# EAGLE board 3x8ButV1.3.6 (EAGLE 6.6.0)
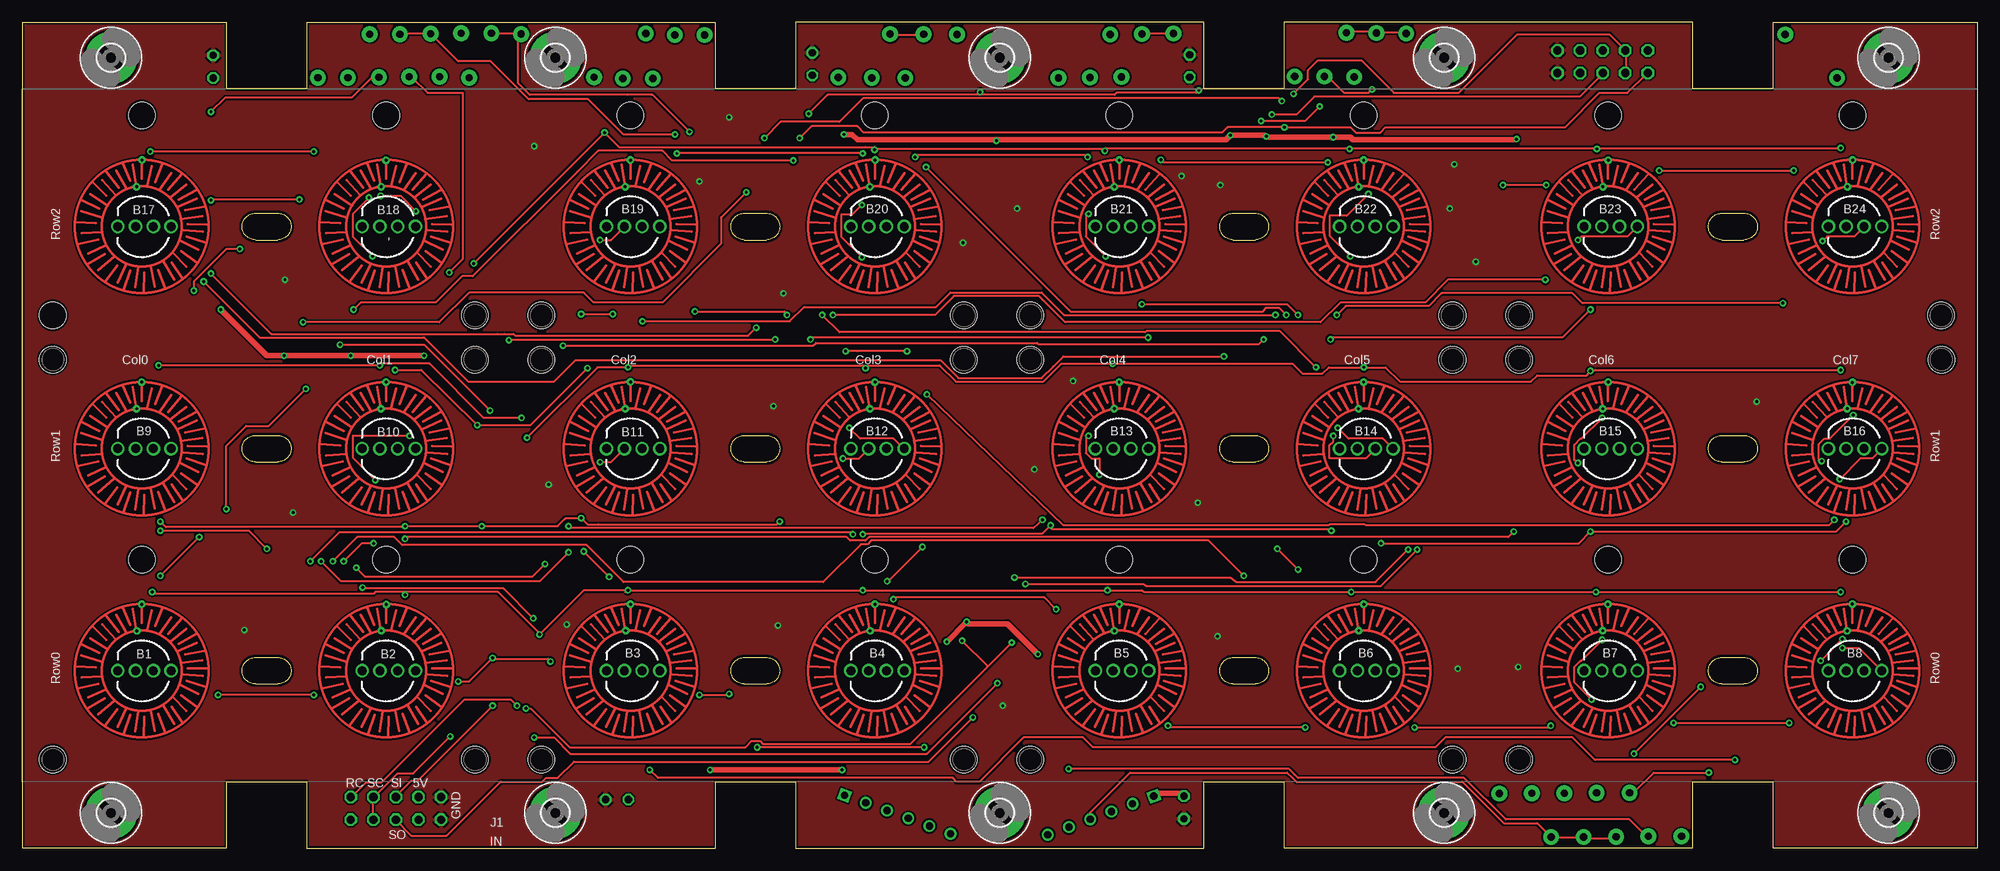
[diagram p1: board, top side]
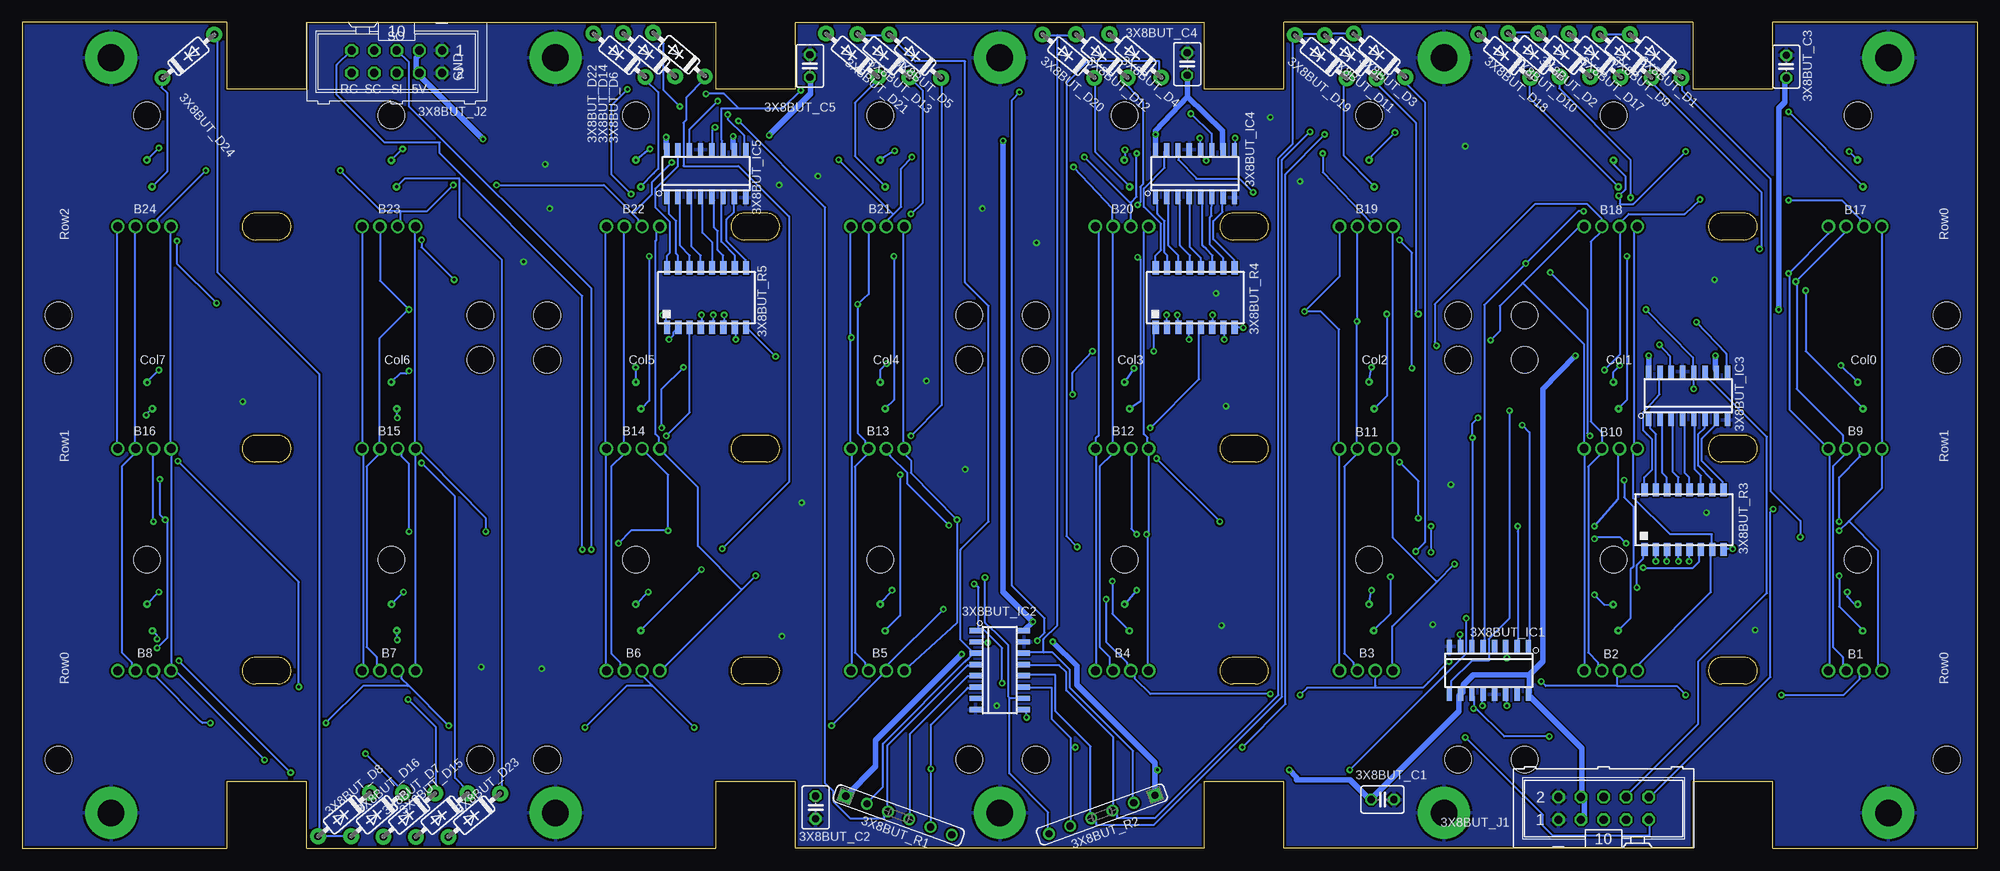
[diagram p2: board, bottom side, seen from below]

Size 220 x 93 mm. Coordinates in mm from the lower left corner, seen from the top.
Outline: 32,0 78,0 78,7.5 87,7.5 87,0 133,0 133,7.5 142,7.5 142,0 188,0 188,7.5 197,7.5 197,0 220,0 220,93 197,93 197,85.5 188,85.5 188,93 142,93 142,85.5 133,85.5 133,93 87,93 87,85.5 78,85.5 78,93 32,93 32,85.5 23,85.5 23,93 0,93 0,0 23,0 23,7.5 32,7.5 32,0
Copper layers (1*16): Top 0.035mm / dielectric 1.5mm / Bottom 0.035mm
Design rules "makePCB *": minimum track width 8mil, minimum drill 13mil, track to track 8mil, track to pad 8mil, pad to pad 8mil, via to via 8mil, smd to smd 8mil, copper to edge 10mil, drill to drill 8mil, minimum pad ring 10mil, minimum via ring 8mil, stop-mask expansion 4mil, vias tented up to drill 0mil, thermal gap 10mil
Net classes: 1 VDD: width 0.61 mm, drill 0.33 mm, clearance 0.355 mm to class 0, clearance 0.355 mm

## Footprints (pad centres in the part's own frame; a part is rotated, then mirrored left to right if it is on the bottom)
BUTTONPAD3X8 = drill 1: BLU1 14.75,12.5; BLU2 42.25,12.5; BLU3 69.75,12.5; BLU4 97.25,12.5; BLU5 124.75,12.5; BLU6 152.25,12.5; BLU7 179.75,12.5; BLU8 207.25,12.5; BLU9 14.75,37.5; BLU10 42.25,37.5; BLU11 69.75,37.5; BLU12 97.25,37.5; BLU13 124.75,37.5; BLU14 152.25,37.5; BLU15 179.75,37.5; BLU16 207.25,37.5; BLU17 14.75,62.5; BLU18 42.25,62.5; BLU19 69.75,62.5; BLU20 97.25,62.5; BLU21 124.75,62.5; BLU22 152.25,62.5; BLU23 179.75,62.5; BLU24 207.25,62.5; GND1 12.75,12.5; GND2 40.25,12.5; GND3 67.75,12.5; GND4 95.25,12.5; GND5 122.75,12.5; GND6 150.25,12.5; GND7 177.75,12.5; GND8 205.25,12.5; GND9 12.75,37.5; GND10 40.25,37.5; GND11 67.75,37.5; GND12 95.25,37.5; GND13 122.75,37.5; GND14 150.25,37.5; GND15 177.75,37.5; GND16 205.25,37.5; GND17 12.75,62.5; GND18 40.25,62.5; GND19 67.75,62.5; GND20 95.25,62.5; GND21 122.75,62.5; GND22 150.25,62.5; GND23 177.75,62.5; GND24 205.25,62.5; GRN1 16.75,12.5; GRN2 44.25,12.5; GRN3 71.75,12.5; GRN4 99.25,12.5; GRN5 126.75,12.5; GRN6 154.25,12.5; GRN7 181.75,12.5; GRN8 209.25,12.5; GRN9 16.75,37.5; GRN10 44.25,37.5; GRN11 71.75,37.5; GRN12 99.25,37.5; GRN13 126.75,37.5; GRN14 154.25,37.5; GRN15 181.75,37.5; GRN16 209.25,37.5; GRN17 16.75,62.5; GRN18 44.25,62.5; GRN19 71.75,62.5; GRN20 99.25,62.5; GRN21 126.75,62.5; GRN22 154.25,62.5; GRN23 181.75,62.5; GRN24 209.25,62.5; RED1 10.75,12.5; RED2 38.25,12.5; RED3 65.75,12.5; RED4 93.25,12.5; RED5 120.75,12.5; RED6 148.25,12.5; RED7 175.75,12.5; RED8 203.25,12.5; RED9 10.75,37.5; RED10 38.25,37.5; RED11 65.75,37.5; RED12 93.25,37.5; RED13 120.75,37.5; RED14 148.25,37.5; RED15 175.75,37.5; RED16 203.25,37.5; RED17 10.75,62.5; RED18 38.25,62.5; RED19 65.75,62.5; RED20 93.25,62.5; RED21 120.75,62.5; RED22 148.25,62.5; RED23 175.75,62.5; RED24 203.25,62.5 | drill 0.33: SIG01 13.447,19.983; SIG02 12.888,16.986; SIG03 40.972,19.958; SIG04 40.413,17.012; SIG05 68.447,19.983; SIG06 67.913,17.012; SIG07 95.947,19.983; SIG08 95.413,16.986; SIG09 123.447,19.983; SIG10 122.888,16.986; SIG11 150.972,19.983; SIG12 150.388,17.012; SIG13 178.447,19.983; SIG14 177.863,17.012; SIG15 205.947,20.009; SIG16 205.363,16.986; SIG17 13.447,44.983; SIG18 12.863,41.986; SIG19 40.947,44.983; SIG20 40.363,41.986; SIG21 68.447,45.009; SIG22 67.863,41.986; SIG23 95.947,44.983; SIG24 95.388,41.986; SIG25 123.447,44.983; SIG26 122.888,42.012; SIG27 150.947,44.983; SIG28 150.363,41.986; SIG29 178.472,44.983; SIG30 177.863,41.986; SIG31 205.947,44.958; SIG32 205.363,42.012; SIG33 13.472,69.983; SIG34 12.863,66.986; SIG35 40.947,69.958; SIG36 40.388,66.986; SIG37 68.447,69.983; SIG38 67.863,66.986; SIG39 95.972,69.983; SIG40 95.388,66.986; SIG41 123.447,69.983; SIG42 122.888,66.986; SIG43 150.947,69.983; SIG44 150.388,66.986; SIG45 178.472,69.958; SIG46 177.888,66.986; SIG47 205.972,69.983; SIG48 205.388,66.986 | hole 3: 13.45,25; 40.95,25; 68.45,25; 95.95,25; 3.434,47.516; 105.966,47.516; 123.45,25; 150.95,25; 178.45,25; 205.95,25; 113.434,47.516; 215.966,47.516; 13.45,75; 40.95,75; 68.45,75; 95.95,75; 123.45,75; 150.95,75; 178.45,75; 205.95,75; 3.434,2.516; 3.434,52.516; 215.934,52.516; 215.934,2.516; 113.434,2.516; 105.934,2.516; 105.934,52.516; 113.434,52.516; 50.934,52.516; 58.434,52.516; 58.434,47.516; 50.934,47.516; 50.934,2.516; 58.434,2.516; 160.934,52.516; 168.434,52.516; 168.434,47.516; 160.934,47.516; 160.934,2.516; 168.434,2.516
C025-030X050 = drill 0.813 octagon: 1 -1.27,0; 2 1.27,0
DO35-7 = drill 0.813 pad 1.778: A 3.81,0; C -3.81,0
SO16D = smd 0.6 x 1.4: 1 -4.481,-2.764; 2 -3.211,-2.764; 3 -1.941,-2.764; 4 -0.671,-2.764; 5 0.599,-2.764; 6 1.869,-2.764; 7 3.139,-2.764; 8 4.409,-2.764; 9 4.409,2.666; 10 3.139,2.666; 11 1.869,2.666; 12 0.599,2.666; 13 -0.671,2.666; 14 -1.941,2.666; 15 -3.211,2.666; 16 -4.481,2.666
ML10 = drill 0.914 octagon: 1 -5.08,-1.27; 2 -5.08,1.27; 3 -2.54,-1.27; 4 -2.54,1.27; 5 0,-1.27; 6 0,1.27; 7 2.54,-1.27; 8 2.54,1.27; 9 5.08,-1.27; 10 5.08,1.27
SIL6 = drill 0.813 square: 1 -6.35,0 | drill 0.813: 2 -3.81,0; 3 -1.27,0; 4 1.27,0; 5 3.81,0; 6 6.35,0
SOIC16W = smd 0.7 x 1.5: 1 -4.445,-3.346; 2 -3.175,-3.346; 3 -1.905,-3.346; 4 -0.635,-3.346; 5 0.635,-3.346; 6 1.905,-3.346; 7 3.175,-3.346; 8 4.445,-3.346; 9 4.445,3.346; 10 3.175,3.346; 11 1.905,3.346; 12 0.635,3.346; 13 -0.635,3.346; 14 -1.905,3.346; 15 -3.175,3.346; 16 -4.445,3.346
3,0-PAD = drill 3 pad 5.842: B3,0 0,0

## Placement (x,y rotation side)
3X8BUT  BUTTONPAD3X8  [BUTTONPAD3X8]  0,7.5 0 top
3X8BUT_C1  100nF  [C025-030X050]  66.93,5.5 0 bottom
3X8BUT_C2  100nF  [C025-030X050]  130.72,4.61 270 bottom
3X8BUT_C3  100n  [C025-030X050]  21.5,88 90 bottom
3X8BUT_C4  100n  [C025-030X050]  88.9,88.29 90 bottom
3X8BUT_C5  100n  [C025-030X050]  131.37,88.08 90 bottom
3X8BUT_D1  1N4148  [DO35-7]  36.19,89.21 140 bottom
3X8BUT_D2  1N4148  [DO35-7]  46.46,89.3 140 bottom
3X8BUT_D3  1N4148  [DO35-7]  67.26,89.27 140 bottom
3X8BUT_D4  1N4148  [DO35-7]  94.75,89.22 140 bottom
3X8BUT_D5  1N4148  [DO35-7]  119.52,89.18 140 bottom
3X8BUT_D6  1N4148  [DO35-7]  146.1,89.35 140 bottom
3X8BUT_D7  1N4148  [DO35-7]  176.45,3.76 220 bottom
3X8BUT_D8  1N4148  [DO35-7]  183.8,3.8 220 bottom
3X8BUT_D9  1N4148  [DO35-7]  39.57,89.21 140 bottom
3X8BUT_D10  1N4148  [DO35-7]  49.88,89.32 140 bottom
3X8BUT_D11  1N4148  [DO35-7]  70.51,89.11 140 bottom
3X8BUT_D12  1N4148  [DO35-7]  98.52,89.19 140 bottom
3X8BUT_D13  1N4148  [DO35-7]  123.07,89.24 140 bottom
3X8BUT_D14  1N4148  [DO35-7]  149.46,89.34 140 bottom
3X8BUT_D15  1N4148  [DO35-7]  172.79,3.74 220 bottom
3X8BUT_D16  1N4148  [DO35-7]  180.08,3.8 220 bottom
3X8BUT_D17  1N4148  [DO35-7]  43.05,89.26 140 bottom
3X8BUT_D18  1N4148  [DO35-7]  53.22,89.21 140 bottom
3X8BUT_D19  1N4148  [DO35-7]  73.88,89.11 140 bottom
3X8BUT_D20  1N4148  [DO35-7]  102.28,89.18 140 bottom
3X8BUT_D21  1N4148  [DO35-7]  126.63,89.28 140 bottom
3X8BUT_D22  1N4148  [DO35-7]  152.81,89.28 140 bottom
3X8BUT_D23  1N4148  [DO35-7]  169.13,3.73 220 bottom
3X8BUT_D24  1N4148  [DO35-7]  201.3,89.16 40 bottom
3X8BUT_IC1  74HC595SO16D  [SO16D]  55,20 180 bottom
3X8BUT_IC2  74HC165NSO16D  [SO16D]  109.95,20.03 270 bottom
3X8BUT_IC3  74HC595  [SO16D]  32.5,51 0 bottom
3X8BUT_IC4  74HC595  [SO16D]  88,76 0 bottom
3X8BUT_IC5  74HC595  [SO16D]  143,76 0 bottom
3X8BUT_J1  IN  [ML10]  42.05,4.5 0 bottom
3X8BUT_J2  [ML10]  177.85,88.55 180 bottom
3X8BUT_R1  10k  [SIL6]  121.37,3.72 340 bottom
3X8BUT_R2  10k  [SIL6]  98.5,3.82 200 bottom
3X8BUT_R3  [SOIC16W]  33,37 0 bottom
3X8BUT_R4  [SOIC16W]  88,62 0 bottom
3X8BUT_R5  [SOIC16W]  143,62 0 bottom
H1  MOUNT-PAD-ROUND3.0  [3,0-PAD]  10,89 0 top
H2  MOUNT-PAD-ROUND3.0  [3,0-PAD]  60,89 0 top
H3  MOUNT-PAD-ROUND3.0  [3,0-PAD]  110,89 0 top
H4  MOUNT-PAD-ROUND3.0  [3,0-PAD]  160,89 0 top
H5  MOUNT-PAD-ROUND3.0  [3,0-PAD]  210,89 0 top
H6  MOUNT-PAD-ROUND3.0  [3,0-PAD]  10,4 0 top
H7  MOUNT-PAD-ROUND3.0  [3,0-PAD]  60,4 0 top
H8  MOUNT-PAD-ROUND3.0  [3,0-PAD]  110,4 0 top
H9  MOUNT-PAD-ROUND3.0  [3,0-PAD]  160,4 0 top
H10  MOUNT-PAD-ROUND3.0  [3,0-PAD]  210,4 0 top
U$1  [VLRLAB]  2.52,21.34 90 top
U$3  [3X8BUT]  218.44,29.67 90 top
U$4  [3X8BUT]  218.44,29.67 90 bottom
U$5  [VLRLAB]  2.8,45.83 270 bottom

## Tracks (layer width: path | path; a pad name or v marks a point on that pad's centre or on a via)
+5V  (via drill 0.33)
  Top 0.61: v168.15,79.86 168.05,79.76 149.76,79.76 149.45,80.06 v147.52,80.06 140.11,80.06 v140,80.16 139.8,80.26 v135.94,80.26 135.43,79.76 109.73,79.76 | v92.46,80.37 93.37,80.37 93.98,79.76 109.73,79.76 | v22.35,60.66 27.53,55.47 v29.46,55.47 v36.98,55.47 v45.21,55.47 | 3X8BUT_R1.1 127.41,5.89 127.71,6.2 130.35,6.2 130.66,5.89 3X8BUT_C2.1 | v104.04,23.27 v106.27,25.5 106.48,25.3 110.85,25.3 v114.3,21.84 | v92.25,8.84 v77.42,8.84 | v109.63,79.65 109.73,79.76
  Bottom 0.61: 88.9,84.63 88.9,86.56 88.9,86.97 3X8BUT_C4.1 | 88.9,84.63 84.94,80.77 84.94,78.74 3X8BUT_IC4.10 | 88.9,84.63 92.46,80.77 v92.46,80.37 92.46,78.74 3X8BUT_IC4.16 | 3X8BUT_J2.3 175.36,89.81 175.36,89.31 175.67,89 175.67,87.68 175.36,87.38 3X8BUT_J2.4 175.26,86.97 v168.15,79.86 | v140,80.16 140,78.84 139.9,78.74 3X8BUT_IC5.10 | v147.52,80.06 147.52,78.74 3X8BUT_IC5.16 | v135.94,80.26 131.27,84.94 131.27,86.77 3X8BUT_C5.1 | v29.46,55.47 29.46,54.05 29.36,53.75 3X8BUT_IC3.10 | v36.98,55.47 36.98,53.75 3X8BUT_IC3.16 | v22.35,60.66 22.35,83.31 21.64,84.02 21.64,86.56 21.54,86.67 3X8BUT_C3.1 | 50.39,19.51 56.69,19.51 57.81,18.39 57.81,18.29 57.91,18.19 57.91,17.58 58.12,17.37 3X8BUT_IC1.10 58.32,17.17 58.32,15.44 68.17,5.59 3X8BUT_C1.1 68.48,5.59 70.61,7.72 76.61,7.72 76.61,8.03 v77.42,8.84 | 50.39,19.51 50.39,17.58 3X8BUT_IC1.16 50.49,17.27 44.5,11.28 44.5,5.79 3X8BUT_J1.4 44.2,5.79 44.2,3.56 44.5,3.25 3X8BUT_J1.3 | v104.04,23.27 101.3,20.52 101.3,18.39 92.56,9.65 92.56,8.84 | 92.56,8.84 92.56,5.99 3X8BUT_R2.1 | 3X8BUT_IC2.16 107.19,24.59 v106.27,25.5 109.63,28.85 v109.63,79.65 | v114.3,21.84 123.95,12.19 123.95,9.25 127.31,5.89 3X8BUT_R1.1 | v92.25,8.84 92.56,8.84 | v45.21,55.47 48.87,51.71 48.87,21.03 50.39,19.51
BLU1  (via drill 0.33)
  Top 0.203: v135.23,55.37 117.14,55.37 116.03,54.25 114.71,52.93 105.36,52.93 103.33,54.97 62.28,54.97 59.84,52.53 50.19,52.53 45.21,57.51 26.72,57.51 v20.42,63.8
  Bottom 0.203: 3X8BUT.BLU1 14.83,20.02 15.14,20.32 15.14,21.54 16.26,22.66 16.26,42.98 14.83,44.4 14.83,44.91 3X8BUT.BLU9 14.83,45.01 15.14,45.31 15.14,46.53 20.32,51.71 20.32,63.8 v20.42,63.8 14.83,69.39 14.83,69.9 3X8BUT.BLU17 | v135.23,55.37 138.48,58.62 3X8BUT_R5.8
BLU2  (via drill 0.33)
  Top 0.203: v139.7,57.3 139.19,56.79 114.3,56.79 114.2,56.9 89.31,56.9 89,56.59 v60.86,56.59
  Bottom 0.203: 3X8BUT.BLU2 42.27,20.02 42.67,20.42 42.67,20.93 43.79,22.05 43.79,42.98 42.27,44.5 42.27,44.91 3X8BUT.BLU10 42.27,46.84 43.48,48.06 43.48,68.28 42.27,69.49 42.27,69.9 3X8BUT.BLU18 42.27,70 42.27,70.92 43.89,72.54 49.78,72.54 61.06,61.27 61.06,57 v60.86,56.59 | v139.7,57.3 139.7,58.52 139.8,58.62 3X8BUT_R5.7
BLU3  (via drill 0.33)
  Top 0.203: v141.02,60.05 117.25,60.05 114.71,62.59 104.44,62.59 102.82,60.96 87.99,60.96 86.36,59.33 81.79,59.33 v69.8,59.33
  Bottom 0.203: 3X8BUT.BLU3 69.8,20.02 70.21,20.42 70.21,20.93 71.22,21.95 71.22,42.98 69.8,44.4 69.8,44.91 3X8BUT.BLU11 69.8,45.01 v69.8,59.33 69.75,59.33 3X8BUT.BLU19 | v141.02,60.05 141.02,58.73 3X8BUT_R5.6 | 69.8,70 3X8BUT.BLU19 | 69.8,69.9 3X8BUT.BLU19
BLU4  (via drill 0.33)
  Top 0.203: v142.24,60.05 141.43,60.86 140,60.86 139.6,60.45 117.96,60.45 117.86,60.55 v101.7,76.71
  Bottom 0.203: 3X8BUT.BLU4 97.33,20.02 97.64,20.32 97.64,21.54 98.75,22.66 98.75,42.98 97.33,44.4 97.33,44.91 3X8BUT.BLU12 97.33,45.01 97.33,69.9 3X8BUT.BLU20 97.33,70 97.33,72.03 v101.7,76.71 | v142.24,60.05 142.24,58.83 142.34,58.73 3X8BUT_R5.5
BLU5  (via drill 0.33)
  Top 0.203: v143.56,60.05 142.34,61.27 v125.98,61.27
  Bottom 0.203: 3X8BUT.BLU5 124.77,20.02 125.17,20.42 125.17,20.93 126.29,22.05 126.29,42.98 124.77,44.5 124.77,44.91 3X8BUT.BLU13 124.77,45.01 125.17,45.41 125.17,45.92 125.98,46.74 v125.98,61.27 | v143.56,60.05 143.56,58.73 3X8BUT_R5.4 | v125.98,61.27 124.77,62.38 124.77,69.9 3X8BUT.BLU21 | v125.98,61.27 125.98,61.37 v125.98,61.27
BLU6  (via drill 0.33)
  Top 0.203: v147.52,46.43 147.52,45.82 147.12,45.41 147.12,43.89 151.18,43.89 152.2,44.91 3X8BUT.BLU14
  Bottom 0.203: v147.52,46.43 144.88,49.07 144.88,58.62 3X8BUT_R5.3 | 3X8BUT.BLU6 152.3,20.02 152.71,20.42 152.71,20.93 153.72,21.95 153.72,42.98 152.3,44.4 152.3,44.91 3X8BUT.BLU14 152.3,45.01 152.3,69.9 3X8BUT.BLU22
BLU7  (via drill 0.33)
  Top 0.203: v147.22,57.3 147.42,57.51 173.33,57.51 v176.48,60.66
  Bottom 0.203: 3X8BUT.BLU7 179.83,20.02 180.14,20.32 180.14,21.54 181.25,22.66 181.25,42.98 179.83,44.4 179.83,44.91 3X8BUT.BLU15 179.83,45.01 179.83,57.4 176.58,60.66 v176.48,60.66 179.73,63.91 179.73,69.9 3X8BUT.BLU23 | v147.22,57.3 146.71,57.81 146.71,58.12 146.2,58.62 3X8BUT_R5.2
BLU8  (via drill 0.33)
  Top 0.203: v147.93,60.05 148.95,61.06 158.29,61.06 159.72,62.48 174.45,62.48 175.56,61.37 v198.12,61.37 | v202.59,68.38 203.1,68.89 206.15,68.89 207.16,69.9 3X8BUT.BLU24
  Bottom 0.203: 3X8BUT.BLU8 207.26,20.02 207.67,20.42 207.67,20.93 208.79,22.05 208.79,42.98 207.26,44.5 207.26,44.91 3X8BUT.BLU16 207.26,45.01 207.37,45.11 207.37,69.8 207.26,69.9 3X8BUT.BLU24 | v147.93,60.05 147.62,59.74 147.62,58.83 147.52,58.73 3X8BUT_R5.1 | v202.59,68.38 202.59,65.84 v198.12,61.37
GND  (via drill 0.33)
  other vias: 110.34,16.05 85.04,25.1 61.26,25.2 24.99,24.59 30.48,37.8 29.57,64.01 57.61,79.04 76.2,75.08 79.55,82.3 85.65,62.48 105.87,68.17 111.96,72.03 130.45,75.69 118.26,52.63 113.89,42.67 134.82,74.68 132.28,38.91 161.14,77.01 160.63,72.03 163.58,66.04 195.17,50.29 168.35,20.42 161.54,20.22 134.52,23.88 84.53,49.78 59.23,40.94
  pour Bottom: 0,93 220,93 220,0 197,0 197,7.5 188,7.5 188,0 142,0 142,7.5 133,7.5 133,0 87,0 87,7.5 78,7.5 78,0 32,0 32,7.5 23,7.5 23,0 0,0
  pour Top: 220,93 220,0 197,0 197,7.5 188,7.5 188,0 142,0 142,7.5 133,7.5 133,0 87,0 87,7.5 78,7.5 78,0 32,0 32,7.5 23,7.5 23,0 0,0 0,93
GND1  (via drill 0.33)
  Top 0.203: v49.07,18.8 50.29,18.8 v52.93,21.44 52.93,21.34 59.13,21.34 v59.44,21.03 | v32.82,17.27 v22.05,17.27 | v79.55,17.37 79.45,17.27 v76.2,17.27 | v128.93,13.82 129.13,13.61 v144.37,13.61 | v172.01,13.82 171.81,13.61 v156.67,13.61 | v185.83,14.12 v198.83,14.12 | v98.04,28.04 98.25,28.25 115.01,28.25 v116.33,26.92
  Bottom 0.203: v52.93,21.44 52.93,22.66 53.03,22.76 3X8BUT_IC1.3 | v49.07,18.8 48.56,18.29 40.54,18.29 | 40.54,18.29 40.54,19.3 40.34,19.51 40.34,19.91 3X8BUT.GND2 | v22.05,17.27 15.04,17.27 13.21,19.1 13.21,19.51 12.8,19.91 3X8BUT.GND1 | v32.82,17.27 33.83,18.29 40.54,18.29 | 67.77,18.09 67.72,18.34 | 67.72,18.34 67.67,19.91 3X8BUT.GND3 | 67.77,18.09 62.38,18.09 61.77,18.69 v59.44,21.03 | v79.55,17.37 93.07,17.37 94.79,19.1 94.79,19.51 95.2,19.91 3X8BUT.GND4 95.3,20.02 95.71,20.42 95.71,20.93 98.04,23.27 v98.04,28.04 | v76.2,17.27 75.39,18.09 67.77,18.09 | 67.77,18.09 67.72,18.34 | v128.93,13.82 122.83,19.91 3X8BUT.GND5 122.73,20.02 122.73,20.52 v116.33,26.92 | 149.1,18.34 150.16,19.41 150.16,19.91 3X8BUT.GND6 | 149.1,18.34 v144.37,13.61 | v172.01,13.82 176.53,18.34 | 176.53,18.34 177.29,19.1 177.29,19.51 177.7,19.91 3X8BUT.GND7 | v156.67,13.61 151.99,18.29 149.15,18.29 149.1,18.34 | v198.83,14.12 199.75,14.12 199.95,14.33 204.83,19.2 204.83,19.51 205.23,19.91 3X8BUT.GND8 | v185.83,14.12 181.66,18.29 176.58,18.29 176.53,18.34
GND9  (via drill 0.33)
  Top 0.203: v51.71,36.27 51.61,36.27 v43.08,36.27 42.98,36.17 16.15,36.17 v15.54,36.78 | v65.02,43.48 66.24,43.48 67.67,44.91 3X8BUT.GND11 | v51.71,36.27 51.31,36.27 v51.71,36.27 | v51.71,36.27 60.25,36.27 61.06,37.08 61.16,37.19 v62.89,37.19 63.6,36.47 64.82,36.47 84.94,36.47 v85.24,36.78 | v92.35,43.89 94.18,43.89 95.2,44.91 3X8BUT.GND12 | v94.59,35.36 94.69,35.46 114.81,35.46 v115.72,36.37 115.62,36.17 115.93,35.97 147.12,35.97 v147.32,35.76 | v152.91,34.34 175.16,34.34 v176.48,35.66 204.11,35.66 v205.23,36.78
  Bottom 0.203: v51.71,36.27 51.71,35.66 51.71,22.86 3X8BUT_IC1.2 | v43.08,36.27 40.44,39.32 40.44,44.81 40.34,44.91 3X8BUT.GND10 | v15.54,36.78 15.54,41.76 13.21,44.09 13.21,44.5 12.8,44.91 3X8BUT.GND9 | v65.02,43.48 62.89,41.35 v62.89,37.19 | v85.24,36.78 v92.35,43.89 | v115.72,36.37 120.4,41.05 120.4,42.27 122.33,44.2 122.33,44.5 122.73,44.91 3X8BUT.GND13 | v94.59,35.36 95.2,35.97 95.2,44.91 3X8BUT.GND12 | 3X8BUT.GND14 150.16,44.91 147.32,42.06 v147.32,35.76 151.49,35.76 v152.91,34.34 | v176.48,35.66 176.48,43.28 177.29,44.09 177.29,44.5 177.7,44.91 3X8BUT.GND15 | v205.23,36.78 205.23,44.91 3X8BUT.GND16
GND17  (via drill 0.33)
  Top 0.203: v41.96,53.85 44.91,53.85 v51.21,47.65 51.41,47.65 57.2,47.65 v63.6,54.05 | v21.23,72.95 21.34,73.05 v31.19,73.05 | v65.02,68.48 66.24,68.48 67.67,69.9 3X8BUT.GND19 | v119.89,77.83 119.69,78.03 100.69,78.03 v100.48,77.83 | v171.5,74.68 v166.62,74.68 | v184.2,76.3 v199.34,76.3 | v128.12,77.52 128.42,77.22 v146.91,77.22 | v94.59,78.23 v73.66,78.23
  Bottom 0.203: v51.21,47.65 50.39,46.84 50.39,22.96 50.49,22.86 3X8BUT_IC1.1 | v41.96,53.85 40.23,55.58 40.23,69.9 3X8BUT.GND18 40.23,70.1 40.23,70.41 39.22,71.42 32.92,71.42 v31.19,73.05 | v21.23,72.95 15.24,72.95 13.21,70.92 13.21,70.41 12.8,70 3X8BUT.GND17 | v65.02,68.48 63.6,67.06 v63.6,54.05 | v100.48,77.83 95.3,72.64 | 95.3,72.64 95.25,72.69 | 95.25,72.69 95.3,70.51 95.3,70 3X8BUT.GND20 | v119.89,77.83 121.11,76.5 121.11,72.24 121.97,71.37 | 121.97,71.37 122.73,70.61 122.73,70 3X8BUT.GND21 | 151.33,71.48 154.53,74.68 v166.62,74.68 | 151.33,71.48 150.67,70.81 150.67,70.41 150.27,70 3X8BUT.GND22 | v171.5,74.68 174.45,71.73 177.39,71.73 | 177.39,71.73 177.39,70.31 177.7,70 3X8BUT.GND23 | v199.34,76.3 204.83,70.81 204.83,70.41 205.23,70 3X8BUT.GND24 | v184.2,76.3 179.63,71.73 177.39,71.73 | v128.12,77.52 122.02,71.42 121.97,71.37 | v146.91,77.22 149.15,74.98 149.15,73.66 151.28,71.53 151.33,71.48 | v73.66,78.23 73.66,76.1 68.17,70.41 67.77,70 3X8BUT.GND19 | v94.59,78.23 94.59,73.36 95.25,72.69 | 95.3,72.64 95.25,72.69 | 95.25,72.69 95.3,72.64 | 95.3,72.64 95.25,72.69 | 95.25,72.69 95.3,72.64 | 95.3,72.64 95.25,72.69 | 95.3,72.64 95.25,72.69
GRN1  (via drill 0.33)
  Top 0.203: v82.6,58.62 81.69,57.71 55.47,57.71 55.27,57.91 54.25,57.91 53.44,57.91 28.04,57.91 v21.23,64.72
  Bottom 0.203: 3X8BUT.GRN1 16.66,20.02 16.66,44.91 3X8BUT.GRN9 16.76,45.01 21.13,49.38 21.13,64.72 v21.23,64.72 16.76,69.19 16.76,69.9 3X8BUT.GRN17 | v82.6,58.62 83.52,58.62 3X8BUT_R4.8
GRN2  (via drill 0.33)
  Top 0.203: 54.86,57.3 v84.73,57.3 | 54.86,57.3 54.76,57.3 54.86,57.3 | v54.76,57.2 54.86,57.3
  Bottom 0.203: 3X8BUT.GRN2 44.2,20.02 44.2,44.91 3X8BUT.GRN10 44.3,45.01 44.3,56.79 51.1,63.6 51.16,63.65 | v84.73,57.3 84.73,58.62 3X8BUT_R4.7 | v54.76,57.2 53.75,58.22 53.75,61.06 51.16,63.65 | 51.16,63.65 44.91,69.9 44.3,69.9 3X8BUT.GRN18
GRN3  (via drill 0.33)
  Top 0.203: v86.06,60.05 85.75,60.45 v75.69,60.45
  Bottom 0.203: v86.06,60.05 86.06,58.73 3X8BUT_R4.6 | 3X8BUT.GRN19 71.73,64.41 v75.69,60.45 73.86,60.45 71.83,58.42 71.83,45.01 3X8BUT.GRN11 71.83,44.91 71.83,20.02 3X8BUT.GRN3
GRN4  (via drill 0.33)
  Top 0.203: v93.07,47.35 94.28,46.13 98.04,46.13 99.16,45.01 3X8BUT.GRN12
  Bottom 0.203: v93.07,47.35 87.58,52.83 87.58,58.42 87.38,58.62 3X8BUT_R4.5 | 3X8BUT.GRN4 99.16,20.02 99.16,44.91 3X8BUT.GRN12 99.16,45.01 99.16,46.23 98.86,46.53 98.86,69.6 99.16,69.9 3X8BUT.GRN20
GRN5  (via drill 0.33)
  Top 0.203: v88.7,57.3 88.9,57.51 v126.69,57.51
  Bottom 0.203: v88.7,57.3 88.7,58.62 3X8BUT_R4.4 | 3X8BUT.GRN5 126.69,20.02 126.69,44.91 3X8BUT.GRN13 126.8,45.01 126.8,57.4 v126.69,57.51 126.8,57.51 126.8,69.9 3X8BUT.GRN21
GRN6  (via drill 0.33)
  Top 0.203: v90.02,60.05 91.95,58.12 126.39,58.12 126.49,58.22 141.53,58.22 v145.59,54.15 | v148.03,47.35 149.25,46.13 153.11,46.13 154.23,45.01 3X8BUT.GRN14
  Bottom 0.203: v90.02,60.05 90.02,58.83 89.92,58.73 3X8BUT_R4.3 | v145.59,54.15 148.03,51.71 v148.03,47.35 | 3X8BUT.GRN6 154.33,20.02 154.33,44.91 3X8BUT.GRN14 154.33,45.01 154.33,69.9 3X8BUT.GRN22
GRN7  (via drill 0.33)
  Top 0.203: v91.24,60.05 102.72,60.05 104.85,62.18 112.88,62.18 112.98,62.18 114.4,62.18 114.81,61.77 114.91,61.67 117.35,59.23 146.1,59.23 148.34,61.47 157.89,61.47 160.43,64.01 v171.4,64.01 | v175.06,68.48 175.46,68.89 180.65,68.89 181.66,69.9 3X8BUT.GRN23
  Bottom 0.203: 3X8BUT.GRN7 181.66,20.02 181.66,44.91 3X8BUT.GRN15 181.76,45.01 181.76,69.9 3X8BUT.GRN23 | v91.24,60.05 91.24,58.73 3X8BUT_R4.2 | v175.06,68.48 175.06,67.67 v171.4,64.01
GRN8  (via drill 0.33)
  Top 0.203: v92.66,55.98 93.98,55.98 v99.57,55.98 | v101.8,51.1 117.14,36.37 147.01,36.37 147.12,36.47 151.08,36.47 151.18,36.37 203.3,36.37 v203.91,36.98 | v204.52,41.55 206.86,43.89 208.18,43.89 209.19,44.91 3X8BUT.GRN16 | v204.83,22.55 206.65,22.55 209.19,20.02 3X8BUT.GRN8
  Bottom 0.203: v92.66,55.98 92.66,58.42 92.46,58.62 3X8BUT_R4.1 | v99.57,55.98 101.8,53.54 v101.8,51.1 | v204.52,41.55 204.52,37.59 v203.91,36.98 203.71,36.78 203.71,23.67 v204.83,22.55 | 3X8BUT.GRN24 209.3,69.9 209.3,45.01 3X8BUT.GRN16
N$1  (via drill 0.33)
  Top 0.203: v21.23,82.91 22.86,84.53 37.08,84.53 39.32,86.77 40.13,86.77 3X8BUT_D17.C
  Bottom 0.203: v21.23,82.91 12.9,74.57 3X8BUT.SIG34
N$2  (via drill 0.33)
  Top 0.203: v24.49,67.46 22.96,67.46 22.86,67.36 19.3,63.8 v19.3,62.79
  Bottom 0.203: v19.3,62.79 19.3,55.98 12.9,49.58 3X8BUT.SIG18 | v24.49,67.46 24.28,67.67 24.28,73.86 36.58,86.16 36.58,86.67 3X8BUT_D9.C
N$3  (via drill 0.33)
  Top 0.203: v19.91,35.05 v15.54,30.68
  Bottom 0.203: v15.54,30.68 15.54,27.23 12.9,24.59 3X8BUT.SIG02 | v19.91,35.05 19.91,36.88 23.27,40.23 23.27,75.39 33.22,85.34 33.22,86.67 3X8BUT_D1.C
N$4
  Bottom 0.203: 3X8BUT.SIG36 40.44,74.57 50.39,84.53 50.39,86.67 3X8BUT_D18.C
N$5  (via drill 0.33)
  Top 0.203: v39.42,66.65 37.19,68.89 37.19,71.42 v39.01,73.25
  Bottom 0.203: v39.42,66.65 39.42,50.49 40.34,49.58 3X8BUT.SIG20 | v39.01,73.25 39.01,77.52 47.04,85.55 47.04,86.77 3X8BUT_D10.C
N$6  (via drill 0.33)
  Top 0.203: v39.73,41.45 37.19,43.99 37.19,46.43 v43.59,46.43 | v48.06,64.82 49.58,66.34 49.58,85.04 45.62,85.04 43.89,86.77 43.59,86.77 3X8BUT_D2.C
  Bottom 0.203: v39.73,41.45 39.73,39.52 38.71,38.51 38.71,31.7 39.01,31.39 39.01,25.91 40.34,24.59 3X8BUT.SIG04 | v43.59,46.43 43.89,46.74 43.89,60.66 v48.06,64.82
N$7
  Bottom 0.203: 3X8BUT.SIG38 67.87,74.57 71.32,78.03 71.32,85.85 71.02,86.16 71.02,86.56 3X8BUT_D19.C
N$8  (via drill 0.33)
  Top 0.203: v66.45,60.15 62.99,60.15 v62.89,60.15
  Bottom 0.203: v66.45,60.15 66.45,50.9 67.77,49.58 3X8BUT.SIG22 | v62.89,60.15 63.2,60.45 63.2,81.69 67.56,86.06 67.56,86.56 3X8BUT_D11.C
N$9
  Bottom 0.203: 3X8BUT_IC5.15 146.2,78.64 146.2,76.81 148.74,74.27 148.74,72.14 147.12,70.51 147.12,67.06 147.42,66.75 147.42,65.43 3X8BUT_R5.16
N$10
  Bottom 0.203: 3X8BUT_IC5.1 147.42,73.15 147.22,72.95 147.22,71.42 146.41,70.61 146.41,66.95 146.2,66.75 146.2,65.43 3X8BUT_R5.15
N$11
  Bottom 0.203: 3X8BUT_IC5.2 146.2,73.15 146,72.95 146,67.87 144.88,66.75 144.88,65.43 3X8BUT_R5.14
N$12
  Bottom 0.203: 3X8BUT_IC5.3 144.88,73.15 144.68,72.95 144.68,67.77 143.66,66.75 143.66,65.43 3X8BUT_R5.13
N$13
  Bottom 0.203: 3X8BUT_IC5.4 143.66,73.15 143.46,72.95 143.46,69.29 142.34,68.17 142.34,65.43 3X8BUT_R5.12
N$14
  Bottom 0.203: 3X8BUT_IC5.5 142.34,73.15 142.14,72.95 142.14,69.9 141.73,69.49 141.73,67.36 141.12,66.75 141.12,65.43 3X8BUT_R5.11
N$15
  Bottom 0.203: 3X8BUT_IC5.6 141.22,73.15 141.33,73.05 141.33,68.28 139.8,66.75 139.8,65.43 3X8BUT_R5.10
N$16
  Bottom 0.203: 3X8BUT_IC5.7 139.9,73.15 139.9,71.63 140.72,70.81 140.72,68.38 138.58,66.24 138.58,65.43 3X8BUT_R5.9
N$17
  Bottom 0.203: 3X8BUT_IC3.15 35.76,53.65 35.76,53.54 35.76,51.1 37.59,49.07 37.59,47.04 37.19,46.63 36.58,46.02 36.58,42.67 37.49,41.76 37.49,40.44 3X8BUT_R3.16
N$18
  Bottom 0.203: 3X8BUT_IC3.1 36.88,48.16 36.78,48.06 36.78,47.24 36.17,46.63 36.17,40.44 3X8BUT_R3.15
N$19
  Bottom 0.203: 3X8BUT_IC3.2 35.66,48.16 35.46,47.95 35.46,42.27 34.95,41.76 34.95,40.44 3X8BUT_R3.14
N$20
  Bottom 0.203: 3X8BUT_IC3.3 34.34,48.16 34.24,48.06 34.24,42.37 33.63,41.76 33.63,40.44 3X8BUT_R3.13
N$21
  Bottom 0.203: 3X8BUT_IC3.4 33.12,48.16 32.92,47.95 32.92,42.27 32.41,41.76 32.41,40.44 3X8BUT_R3.12
N$22
  Bottom 0.203: 3X8BUT_IC3.5 31.8,48.16 31.8,42.67 31.09,41.96 31.09,40.44 3X8BUT_R3.11
N$23
  Bottom 0.203: 3X8BUT_IC3.6 30.68,48.16 30.68,47.35 31.39,46.63 31.39,43.08 29.87,41.55 29.87,40.44 3X8BUT_R3.10
N$24
  Bottom 0.203: 3X8BUT_IC3.7 29.36,48.16 29.46,47.85 29.46,47.65 30.99,46.13 30.99,43.59 28.65,41.25 28.65,40.44 3X8BUT_R3.9
N$65
  Bottom 0.203: 3X8BUT_IC4.15 91.24,78.64 91.44,78.44 91.44,76.61 93.78,74.27 93.78,72.24 91.85,70.31 91.85,67.36 92.46,66.75 92.46,65.43 3X8BUT_R4.16
N$66
  Bottom 0.203: 3X8BUT_IC4.1 92.46,73.15 92.25,72.95 92.25,71.42 91.44,70.61 91.44,67.06 91.14,66.75 91.14,65.43 3X8BUT_R4.15
N$67
  Bottom 0.203: 3X8BUT_IC4.2 91.14,73.15 91.03,73.05 91.03,67.87 89.92,66.75 89.92,65.43 3X8BUT_R4.14
N$68
  Bottom 0.203: 3X8BUT_IC4.3 89.92,73.15 89.71,72.95 89.71,67.87 88.59,66.75 88.59,65.43 3X8BUT_R4.13
N$69
  Bottom 0.203: 3X8BUT_IC4.4 88.59,73.15 88.59,67.67 87.38,66.45 87.38,65.43 3X8BUT_R4.12
N$70
  Bottom 0.203: 3X8BUT_IC4.5 87.38,73.15 87.17,72.95 87.17,67.87 86.77,67.46 86.06,66.75 86.06,65.43 3X8BUT_R4.11
N$71
  Bottom 0.203: 3X8BUT_IC4.6 86.16,71.22 86.36,71.02 86.36,67.97 84.84,66.45 84.84,65.43 3X8BUT_R4.10
N$72
  Bottom 0.203: 3X8BUT_IC4.7 84.94,73.15 84.94,71.63 85.95,70.61 85.95,68.58 83.62,66.24 83.62,65.43 3X8BUT_R4.9
N$73  (via drill 0.33)
  Top 0.203: v63.2,33.43 v66.04,30.58
  Bottom 0.203: v66.04,30.58 66.04,26.42 67.87,24.59 3X8BUT.SIG06 | v63.2,33.43 62.18,34.44 62.18,84.02 64.31,86.16 64.31,86.77 3X8BUT_D3.C
N$74
  Bottom 0.203: 3X8BUT.SIG40 95.4,74.57 99.26,78.44 99.26,86.67 3X8BUT_D20.C
N$75  (via drill 0.33)
  Top 0.203: v94.49,66.55 92.15,68.89 92.15,71.32 93.37,71.32 v94.49,72.44
  Bottom 0.203: v94.49,66.55 94.39,66.55 94.18,66.34 94.18,50.29 95.3,49.58 3X8BUT.SIG24 | v94.49,72.44 94.18,72.75 94.18,74.47 93.88,74.78 93.88,83.72 93.88,84.02 95.5,85.75 95.5,86.67 3X8BUT_D12.C
N$76  (via drill 0.33)
  Top 0.203: v101.3,33.93 97.54,30.18 v97.33,30.07
  Bottom 0.203: v97.33,30.07 97.33,26.42 95.5,24.59 3X8BUT.SIG08 | v101.3,33.93 102.51,35.15 102.51,86.16 100.08,88.59 92.05,88.59 92.05,87.07 91.85,86.87 3X8BUT_D4.C
N$77
  Bottom 0.203: 3X8BUT.SIG42 122.94,74.57 126.29,77.93 126.29,83.92 123.75,86.46 123.75,86.77 3X8BUT_D21.C
N$78  (via drill 0.33)
  Top 0.203: v121.92,66.65 119.69,68.89 119.69,71.42 v119.99,71.42
  Bottom 0.203: v121.92,66.65 121.92,50.49 122.83,49.58 3X8BUT.SIG26 | v119.99,71.42 118.67,72.64 118.67,85.34 120.09,86.77 3X8BUT_D13.C
N$79  (via drill 0.33)
  Top 0.203: v121.21,42.06 121.21,43.89 120.29,43.89 119.69,44.5 119.69,46.43 v119.99,46.43
  Bottom 0.203: v121.21,42.06 121.21,26.21 122.83,24.59 3X8BUT.SIG10 | v119.99,46.43 116.53,49.89 116.53,86.67 3X8BUT_D5.C
N$80
  Bottom 0.203: 3X8BUT.SIG44 150.37,74.57 148.95,76 148.44,76.5 148.44,85.14 149.86,86.46 149.86,86.77 3X8BUT_D22.C
N$81  (via drill 0.33)
  Top 0.203: v149.45,66.65 147.12,68.99 147.12,71.22 149.05,71.22 v151.49,73.66 | v151.89,85.45 151.49,85.04 148.74,85.04 146.91,86.87 146.61,86.87 3X8BUT_D14.C
  Bottom 0.203: v149.45,66.65 149.45,50.39 150.27,49.58 3X8BUT.SIG28 | v151.49,73.66 153.72,75.89 153.72,83.62 v151.89,85.45
N$82  (via drill 0.33)
  Top 0.203: v141.22,33.73 v143.56,31.39
  Bottom 0.203: v143.56,31.39 145.69,29.26 150.37,24.59 3X8BUT.SIG12 | v141.22,33.73 133.71,41.25 133.71,71.12 139.4,76.81 145.59,76.81 145.59,81.69 145.29,81.99 145.29,84.53 143.26,86.56 143.26,86.87 3X8BUT_D6.C
N$83  (via drill 0.33)
  Top 0.203: v177.8,23.47 175.46,21.13 175.36,21.13 174.65,20.42 174.65,18.69 v176.58,16.76
  Bottom 0.203: v177.8,23.47 177.8,24.49 3X8BUT.SIG14 | v176.58,16.76 173.43,13.61 173.43,6.3 3X8BUT_D7.C
N$84  (via drill 0.33)
  Top 0.203: v177.8,48.46 175.46,46.13 175.36,46.13 174.65,45.41 174.65,43.69 174.75,43.69 v175.06,43.38
  Bottom 0.203: v177.8,48.46 177.8,49.48 3X8BUT.SIG30 | v175.06,43.38 171.3,39.62 171.3,7.92 169.88,6.5 3X8BUT_D15.C
N$85
  Bottom 0.203: 3X8BUT.SIG46 177.8,74.57 176.99,75.39 170.79,75.39 170.79,71.02 166.01,66.24 166.01,6.3 166.12,6.2 3X8BUT_D23.C
N$86
  Bottom 0.203: 3X8BUT.SIG48 205.33,74.57 203.71,76.2 203.71,85.04 204.32,85.65 204.32,86.67 3X8BUT_D24.C
N$87  (via drill 0.33)
  Top 0.203: v206.04,48.77 203.4,46.13 202.79,46.13 202.18,45.52 202.18,43.59 v202.49,43.59 | v181.36,10.67 v188.87,18.19
  Bottom 0.203: v206.04,48.77 206.04,48.87 205.44,49.48 3X8BUT.SIG32 | v202.49,43.59 188.87,29.97 v188.87,18.19 | v181.36,10.67 177.19,6.5 177.19,6.3 3X8BUT_D16.C
N$88  (via drill 0.33)
  Top 0.203: v202.39,21.13 v204.83,23.57 | v189.79,8.53 183.59,8.53 181.36,6.3 180.95,6.3 3X8BUT_D8.C
  Bottom 0.203: v204.83,23.57 204.83,23.98 205.33,24.49 3X8BUT.SIG16 | v189.79,8.53 v202.39,21.13
RC-I  (via drill 0.33)
  Top 0.203: v109.73,18.59 101.8,10.67 61.67,10.67 59.84,12.5 v57.61,12.5 | v156.97,33.63 152.91,29.57 126.49,29.57 126.19,29.77 v112.88,29.77
  Bottom 0.203: 112.37,24.59 111.76,24.59 110.85,23.67 109.73,22.55 v109.73,18.59 | 112.37,24.59 112.67,24.59 3X8BUT_IC2.1 112.37,24.59 | v57.61,12.5 48.87,3.76 48.87,2.54 47.75,1.42 36.88,1.42 36.88,3.15 3X8BUT_J1.9 | v156.97,33.63 156.97,62.18 173.03,78.23 173.03,79.45 179.22,79.45 184.61,84.84 184.61,88.19 182.98,89.81 3X8BUT_J2.9 | v112.88,29.77 112.37,29.36 112.37,24.59
RC-O  (via drill 0.33)
  Top 0.203: v55.68,16.05 54.97,16.76 49.78,16.76 40.44,7.42 38.71,7.42 37.08,5.79 36.98,5.79 3X8BUT_J1.10 | v31.9,51.71 27.74,47.55 25.2,47.55 22.96,45.31 v22.96,38.2 | v87.48,79.96 88.8,81.28 93.98,81.28 94.69,80.57 135.03,80.57 135.64,81.18 v142.04,81.18 149.45,81.18 150.06,80.57 152.81,80.57 153.42,81.18 173.63,81.18 177.5,85.04 180.65,85.04 182.88,87.27 3X8BUT_J2.10 | v37.29,60.66 38.1,61.47 46.53,61.47 49.48,64.41 50.7,64.41 62.48,76.2 64.82,78.54 72.03,78.54 73.15,77.42 v86.77,77.42
  Bottom 0.203: v55.68,16.05 55.68,17.27 3X8BUT_IC1.12 | v31.9,51.71 31.9,53.65 3X8BUT_IC3.12 31.9,53.75 32,53.85 32,55.27 v37.29,60.66 | v22.96,38.2 23.27,37.9 23.27,19.3 36.88,5.69 3X8BUT_J1.10 | v87.48,79.96 87.48,78.74 3X8BUT_IC4.12 87.38,78.64 87.38,78.03 v86.77,77.42 | v142.04,81.18 142.34,80.87 142.34,78.74 3X8BUT_IC5.12
RED1  (via drill 0.33)
  Top 0.203: v27.53,33.73 25.5,35.76 v15.54,35.76
  Bottom 0.203: v27.53,33.73 28.55,33.73 3X8BUT_R3.8 | 14.48,36.83 10.77,40.54 10.77,44.91 3X8BUT.RED9 10.67,45.01 10.67,69.9 3X8BUT.RED17 | 14.48,36.83 v15.54,35.76 | 3X8BUT.RED1 10.77,20.02 11.18,20.42 11.18,33.53 14.43,36.78 14.48,36.83
RED2
  Bottom 0.203: 3X8BUT.RED2 38.2,20.02 38.2,20.62 29.97,28.85 29.97,33.53 29.87,33.63 3X8BUT_R3.7 29.87,33.73 29.87,35.36 34.54,35.36 38.71,39.42 38.71,44.5 38.3,44.91 3X8BUT.RED10 38.61,44.7 38.61,69.6 38.3,69.9 3X8BUT.RED18
RED3  (via drill 0.33)
  Top 0.203: v37.59,31.6 38.61,30.58 57.4,30.58 v58.83,32
  Bottom 0.203: v37.59,31.6 32,31.6 31.29,32.31 31.29,33.53 31.19,33.63 3X8BUT_R3.6 | 60.81,30.02 65.84,24.99 65.84,20.02 3X8BUT.RED3 | 60.81,30.02 v58.83,32 | 60.81,30.02 60.86,30.07 65.73,34.95 65.73,44.91 3X8BUT.RED11 65.73,45.01 65.73,69.9 3X8BUT.RED19
RED4  (via drill 0.33)
  Top 0.203: v32.41,32.31 35.66,35.56 93.27,35.56 v93.47,35.36
  Bottom 0.203: v32.41,32.31 32.41,33.63 3X8BUT_R3.5 | 3X8BUT.RED4 93.27,20.02 93.37,20.12 93.37,35.36 v93.47,35.36 93.27,35.56 93.27,44.91 3X8BUT.RED12 93.37,44.91 93.37,46.23 93.78,46.63 93.78,69.39 93.67,69.49 93.27,69.9 3X8BUT.RED20
RED5  (via drill 0.33)
  Top 0.203: v33.63,32.31 35.87,30.07 40.54,30.07 58.22,30.07 v61.47,33.33 | v61.47,36.27 61.67,36.07 113.79,36.07 v114.81,36.98
  Bottom 0.203: v33.63,32.31 33.63,33.63 3X8BUT_R3.4 | v61.47,36.27 v61.47,33.33 | 3X8BUT.RED5 120.7,20.02 114.81,25.4 v114.81,36.98 119.99,42.27 119.99,43.69 120.7,44.4 120.7,44.91 3X8BUT.RED13 120.8,45.01 120.8,69.9 3X8BUT.RED21
RED6  (via drill 0.33)
  Top 0.203: v34.95,32.31 37.69,35.05 41.86,35.05 42.77,34.14 63.5,34.14 67.67,29.97 90.12,29.97 94.39,34.24 95.1,34.24 95.5,34.65 133.5,34.65 v137.47,30.68
  Bottom 0.203: v34.95,32.31 34.95,33.63 3X8BUT_R3.3 | 139.04,29.11 148.23,19.91 3X8BUT.RED6 | 139.04,29.11 v137.47,30.68 | 139.04,29.11 139.09,29.16 143.97,34.04 143.97,40.64 148.23,44.91 3X8BUT.RED14 148.34,45.01 148.34,46.23 148.74,46.63 148.74,68.38 148.64,68.48 148.64,69.6 148.34,69.9 3X8BUT.RED22
RED7  (via drill 0.33)
  Top 0.203: v36.17,32.31 38.2,34.34 v39.52,34.34 | v43.08,34.85 43.28,35.05 92.76,35.05 93.17,34.65 94.89,34.65 95.3,35.05 167.23,35.05 v167.84,35.66
  Bottom 0.203: v36.17,32.31 36.17,33.63 3X8BUT_R3.2 | v39.52,34.34 40.23,35.05 43.08,35.05 v43.08,34.85 | v167.84,35.66 167.84,37.19 174.35,43.79 175.46,44.91 175.67,44.91 3X8BUT.RED15 | 3X8BUT.RED7 175.77,20.02 175.77,44.91 3X8BUT.RED15 | 3X8BUT.RED23 175.77,69.9 175.77,45.01 3X8BUT.RED15
RED8  (via drill 0.33)
  Top 0.203: v38.3,29.36 38.41,29.26 54.15,29.26 v57.51,25.91 | v70.61,8.84 71.53,7.92 104.75,7.92 105.16,7.52 107.7,7.52 112.67,12.5 119.38,12.5 120.5,11.38 159,11.38 160.12,12.5 174.45,12.5 176.99,9.96 v192.74,9.96
  Bottom 0.203: v38.3,29.36 38.3,31.9 37.59,32.61 37.59,33.53 37.49,33.63 3X8BUT_R3.1 | v57.51,25.91 57.51,21.95 v70.61,8.84 | v192.74,9.96 202.69,19.91 203.2,19.91 3X8BUT.RED8 203.2,20.02 203.2,44.91 3X8BUT.RED16 203.3,45.01 203.3,69.9 3X8BUT.RED24
ROW1  (via drill 0.33)
  Top 0.203: 3X8BUT_D9.A 42.57,91.75 45.92,91.75 3X8BUT_D17.A 46.02,91.64 49.07,88.59 52.73,88.59 57,84.33 63.7,84.33 67.67,80.37 v73.46,80.37 | v101.5,11.38 v82.7,11.38
  Bottom 0.203: 3X8BUT_D1.A 39.12,91.64 42.47,91.64 3X8BUT_D9.A | 102.01,11.38 102.01,2.54 3X8BUT_R2.5 | 102.01,11.38 102.01,12.39 104.14,14.53 104.14,18.09 107.19,18.09 3X8BUT_IC2.11 | v73.46,80.37 77.83,75.89 77.83,16.26 v82.7,11.38 | 102.01,11.38 v101.5,11.38
ROW2  (via drill 0.33)
  Top 0.203: 55.78,91.75 52.83,91.75 3X8BUT_D10.A | 55.78,91.75 56.08,91.75 3X8BUT_D18.A 55.78,91.75 | 55.78,91.75 55.78,86.16 57.1,84.84 68.07,84.84 70.81,84.84 | 70.92,84.84 70.81,84.84 | 70.81,84.84 70.92,84.84 | v75.08,80.67 70.92,84.84 | 70.92,84.84 70.81,84.84
  Bottom 0.203: 3X8BUT_D2.A 49.48,91.85 52.73,91.85 3X8BUT_D10.A | 3X8BUT_IC2.12 107.19,19.51 103.73,19.51 103.73,15.44 99.77,11.48 99.77,3.45 3X8BUT_R2.4 99.67,3.45 99.16,2.95 99.16,2.64 92.66,2.64 78.23,17.07 78.23,77.52 v75.08,80.67
ROW3
  Bottom 0.203: 3X8BUT_D3.A 70.21,91.75 73.36,91.75 73.36,91.64 3X8BUT_D11.A 73.46,91.64 76.71,91.64 3X8BUT_D19.A 76.81,91.54 77.01,91.34 77.01,79.35 78.64,77.72 78.64,17.27 92.46,3.45 96.83,3.45 96.83,3.76 97.23,4.17 3X8BUT_R2.3 97.23,4.27 97.23,12.5 102.51,17.78 102.51,19.81 103.33,20.62 107.19,20.62 3X8BUT_IC2.13
ROW4
  Top 0.203: 3X8BUT_D4.A 97.74,91.64 97.84,91.54 101.4,91.54 3X8BUT_D12.A
  Bottom 0.203: 103.53,91.54 105.16,91.54 3X8BUT_D20.A | 103.53,91.54 101.5,91.54 3X8BUT_D12.A | 105.05,22.05 104.04,22.05 102.11,20.12 102.11,18.09 95,10.97 95,5.18 3X8BUT_R2.2 | 105.05,22.05 107.19,22.05 3X8BUT_IC2.14 | 103.53,91.54 103.53,25.09 105.05,23.57 105.05,22.05
ROW5
  Top 0.203: 3X8BUT_D21.A 129.54,91.75 126.09,91.75 3X8BUT_D13.A
  Bottom 0.203: 3X8BUT_D13.A 125.98,91.64 125.98,91.54 122.53,91.54 3X8BUT_D5.A 122.43,91.54 119.48,88.59 113.89,88.59 113.89,63.7 111.25,61.06 111.25,36.78 114.4,33.63 114.4,23.47 112.88,21.95 3X8BUT_IC2.3 112.78,21.95 112.98,21.95 113.49,21.44 113.89,21.03 123.14,11.79 123.14,6.91 124.87,5.18 124.87,5.08 3X8BUT_R1.2
ROW6  (via drill 0.33)
  Top 0.203: 3X8BUT_D22.A 155.65,91.75 155.55,91.85 152.4,91.85 3X8BUT_D14.A 152.4,91.95 149.15,91.95 149.05,91.85 3X8BUT_D6.A | v146,83.52 144.37,81.89 v139.4,81.89
  Bottom 0.203: 3X8BUT_IC2.4 112.78,20.62 113.59,20.62 113.69,20.52 122.63,11.58 122.63,4.17 3X8BUT_R1.3 122.63,4.06 123.04,3.66 123.04,3.35 126.8,3.35 128.63,5.18 128.63,5.28 128.73,5.38 128.73,6.4 129.64,7.32 129.64,72.14 v139.4,81.89 | v146,83.52 147.83,85.34 147.83,90.63 148.95,91.75 3X8BUT_D6.A
ROW7
  Top 0.203: 3X8BUT_D7.A 179.32,1.22 179.22,1.12 175.67,1.12 3X8BUT_D15.A 175.67,1.22 172.11,1.22 3X8BUT_D23.A 172.01,1.32 170.49,2.85 166.73,2.85 162.05,7.52 143.36,7.52 143.05,7.82 142.95,7.92 142.34,8.53 124.66,8.53 119.99,3.86 119.99,3.35 120.09,3.35 3X8BUT_R1.4
  Bottom 0.203: 3X8BUT_IC2.5 112.78,19.41 113.59,19.41 113.69,19.3 120.09,12.9 120.09,3.35 3X8BUT_R1.4
ROW8  (via drill 0.33)
  Top 0.203: v117.75,8.94 142.54,8.94 143.15,8.33 143.56,7.92 162.25,7.92 166.93,3.25 180.85,3.25 182.68,1.42 182.98,1.42 3X8BUT_D16.A
  Bottom 0.203: 3X8BUT_IC2.6 112.78,18.09 113.59,18.09 113.69,17.98 117.75,13.92 v117.75,8.94 117.75,2.44 3X8BUT_R1.5 | 186.54,1.42 186.64,1.42 3X8BUT_D8.A 186.54,1.42 | 186.54,1.42 183.08,1.42 3X8BUT_D16.A | 186.54,1.42 186.54,53.34 198.02,64.82 198.02,91.24 198.32,91.54 3X8BUT_D24.A
SC  (via drill 0.33)
  Top 0.203: 3X8BUT_J2.8 180.44,87.38 180.44,89.81 3X8BUT_J2.7 180.34,89.92 178.61,91.64 168.25,91.64 161.65,85.04 154.33,85.04 150.67,88.7 145.8,88.7 144.68,87.58 144.68,86.56 v143.05,84.94 | v88.49,82.7 90.63,84.84 107.8,84.84 | 107.8,84.84 122.94,84.84 123.14,85.04 132.08,85.04 v132.38,85.34 | v48.16,12.6 43.99,8.43 42.27,8.43 39.62,5.79 39.52,5.79 3X8BUT_J1.8 39.42,5.69 39.42,3.25 3X8BUT_J1.7 | 108.66,20.47 99.97,11.79 83.31,11.79 83.01,12.09 82.09,12.09 81.38,11.38 61.57,11.38 57.2,15.75 v56.69,15.75 | 108.66,20.47 v111.35,23.16 | v107.8,85.14 107.8,84.84 | v105.77,23.37 108.61,20.52 108.66,20.47
  Bottom 0.203: v88.49,82.7 86.16,80.47 86.16,78.84 86.16,78.74 3X8BUT_IC4.11 | v132.38,85.34 134.42,83.31 139.4,83.31 | 139.4,83.31 141.33,83.31 141.33,79.76 141.22,79.65 141.22,78.74 3X8BUT_IC5.11 | v143.05,84.94 141.02,84.94 139.4,83.31 | 56.54,15.9 53.24,12.6 v48.16,12.6 | 56.54,15.9 56.59,15.95 56.59,17.07 56.79,17.27 3X8BUT_IC1.11 | 3X8BUT_IC3.11 30.58,53.65 30.58,53.24 23.67,46.33 23.67,28.75 31.39,21.03 31.39,14.02 39.42,5.99 39.42,5.79 3X8BUT_J1.8 | v111.35,23.16 112.67,23.16 3X8BUT_IC2.2 | v56.69,15.75 56.59,15.85 56.54,15.9 | v107.8,85.14 108.61,84.23 108.61,29.57 104.95,25.91 104.95,24.28 105.77,23.47 v105.77,23.37
SEL1  (via drill 0.33)
  Top 0.203: v68.17,29.06 63.2,29.06 v58.22,24.08 58.22,24.18 53.54,28.85 43.08,28.85 | 43.08,28.85 43.08,28.75 | 43.08,28.75 v43.08,28.55 43.08,28.75 | 43.08,28.85 39.73,28.85 39.52,28.65 14.73,28.65 14.63,28.75 v14.63,28.85 | 43.08,28.85 43.08,28.75 | 43.08,28.75 43.08,28.85 | 43.08,28.75 43.08,28.85 | v68.17,29.06 67.87,28.85 v68.17,29.06 | v68.17,29.06 v94.59,29.06 v122.12,29.06 125.98,29.06 126.29,28.85 v149.56,28.85 v177.09,28.85 v204.62,28.85
  Bottom 0.203: v58.22,24.08 58.22,22.86 3X8BUT_IC1.7 | v68.17,29.06 68.38,27.74 68.38,27.53 3X8BUT.SIG05 | v43.08,28.55 41.96,27.43 3X8BUT.SIG03 | v14.63,28.85 14.63,28.35 13.82,27.53 13.51,27.53 3X8BUT.SIG01 | v94.59,29.06 95.91,27.53 3X8BUT.SIG07 | v122.12,29.06 123.44,27.53 3X8BUT.SIG09 | v149.56,28.85 150.88,27.53 3X8BUT.SIG11 | v177.09,28.85 178.41,27.53 3X8BUT.SIG13 | v204.62,28.85 205.94,27.53 3X8BUT.SIG15
SEL2  (via drill 0.33)
  Top 0.203: v15.34,54.36 v40.23,54.36 40.13,54.56 45.82,54.56 51.92,48.46 v56.19,48.46 | v56.79,46.23 64.72,54.15 v68.17,54.15 68.38,54.36 94.18,54.36 | 94.59,54.36 94.94,54.3 | 94.94,54.3 v94.89,54.05 | 94.18,54.36 94.59,54.36 | 122.83,54.56 116.94,54.56 114.91,52.53 105.05,52.53 103.23,54.36 94.59,54.36 | 122.83,54.56 v122.73,54.56 122.83,54.56 | 94.18,54.36 94.59,54.36 | 94.18,54.36 94.94,54.3 | 150.98,54.05 v150.98,54.15 | v150.98,54.15 147.01,54.15 146.3,53.44 144.07,53.44 142.95,54.56 122.83,54.56 | v150.98,54.15 150.98,54.05 | v150.98,54.15 153.42,54.15 155.04,52.53 169.77,52.53 170.49,53.24 176.07,53.24 v176.48,53.75 176.99,53.85 v204.62,53.85 | 150.98,54.05 v150.98,54.15 | 150.98,54.05 v150.98,54.15
  Bottom 0.203: v15.34,54.36 13.51,52.53 3X8BUT.SIG17 | v40.23,54.36 40.95,53.65 40.95,52.53 3X8BUT.SIG19 | v68.17,54.15 68.38,52.73 68.38,52.53 3X8BUT.SIG21 | 3X8BUT_IC1.6 56.79,22.86 v56.79,46.23 56.79,47.85 v56.19,48.46 | v94.89,54.05 95.91,52.53 3X8BUT.SIG23 | v122.73,54.56 123.44,53.85 3X8BUT.SIG25 | v150.98,54.15 150.98,52.83 3X8BUT.SIG27 | v176.48,53.75 176.78,53.44 177.5,53.44 178.41,52.53 3X8BUT.SIG29 | v204.62,53.85 205.94,52.53 3X8BUT.SIG31
SEL3  (via drill 0.33)
  Top 0.203: v44.3,71.73 42.57,73.46 v40.34,73.46 | v32.82,78.44 v14.43,78.44 | v50.8,65.84 61.27,76.3 v65.53,80.57 67.16,78.94 94.89,78.94 95.91,78.94 95.91,78.74 | 95.91,78.74 v95.91,78.64 | 95.91,78.74 121.72,78.74 | 121.72,78.74 121.82,78.64 v121.82,78.54 121.72,78.74 | v95.91,78.64 95.91,78.74 | 95.91,78.74 v95.91,78.64 | 95.91,78.74 v95.91,78.64 | 121.72,78.74 121.92,78.84 149.56,78.84 v149.35,78.74 149.66,78.84 177.09,78.84 v177.19,78.74 177.29,78.84 v204.62,78.84
  Bottom 0.203: 50.95,65.68 44.91,71.73 v44.3,71.73 | 50.95,65.68 55.47,61.16 55.47,22.96 55.58,22.86 3X8BUT_IC1.5 | 3X8BUT.SIG35 40.95,77.42 40.95,77.01 39.62,75.69 39.62,74.17 v40.34,73.46 40.23,73.46 40.23,72.54 38.71,72.54 v32.82,78.44 | v14.43,78.44 13.51,77.52 3X8BUT.SIG33 | v65.53,80.57 68.48,77.62 3X8BUT.SIG37 | v50.8,65.84 51,65.73 50.95,65.68 | v95.91,78.64 95.91,77.52 3X8BUT.SIG39 | v121.82,78.54 123.44,77.52 3X8BUT.SIG41 | v149.35,78.74 150.88,77.52 3X8BUT.SIG43 | v177.19,78.74 178.41,77.52 3X8BUT.SIG45 | v204.62,78.84 205.94,77.52 3X8BUT.SIG47
SI-INPUT/J1  (via drill 0.33)
  Top 0.203: v106.98,14.73 102.01,9.75 62.08,9.75 60.25,7.92 58.93,7.92 58.52,7.52 53.85,7.52 47.75,1.42 43.79,1.42 42.06,3.15 3X8BUT_J1.5
  Bottom 0.203: v106.98,14.73 106.98,15.34 107.19,15.54 3X8BUT_IC2.9
SI-OUTPUT  (via drill 0.33)
  Top 0.203: v155.96,33.63 152.3,29.97 136.65,29.97 135.94,30.48 v111.66,30.48
  Bottom 0.203: 108.92,16.97 107.29,16.97 3X8BUT_IC2.10 | 108.92,16.97 108.92,8.43 104.55,4.06 104.55,1.73 3X8BUT_R2.6 | v155.96,33.63 155.96,62.99 176.48,83.52 176.48,88.49 177.8,89.81 3X8BUT_J2.5 | v111.66,30.48 111.66,25.4 110.44,24.28 109.02,22.86 109.02,17.07 108.92,16.97
SO-INPUT/J1  (via drill 0.33)
  Top 0.203: v52.93,16.05 44.5,7.62 43.79,7.62 41.96,5.79 3X8BUT_J1.6
  Bottom 0.203: v52.93,16.05 52.93,17.17 53.03,17.27 3X8BUT_IC1.14
SO-LINK1  (via drill 0.33)
  Top 0.203: v52.63,49.28 45.21,56.69 v35.76,56.69
  Bottom 0.203: v52.63,49.28 52.63,25.91 54.97,23.57 54.97,21.13 56.9,21.13 59.23,18.8 59.23,17.48 59.33,17.37 3X8BUT_IC1.9 | v35.76,56.69 34.54,55.37 34.54,53.85 34.44,53.75 3X8BUT_IC3.14
SO-LINK2  (via drill 0.33)
  Top 0.203: v31.6,59.23 46.94,59.23 50.29,62.59 63.2,62.59 64.31,61.47 72.03,61.47 78.64,68.07 78.64,71.02 v81.48,73.86
  Bottom 0.203: v31.6,59.23 28.25,55.68 28.25,53.85 28.14,53.75 3X8BUT_IC3.9 | v81.48,73.86 83.01,75.39 87.78,75.39 | 87.78,75.39 87.88,75.39 87.78,75.39 | 87.78,75.39 89.92,77.52 89.92,78.64 3X8BUT_IC4.14
SO-LINK3  (via drill 0.33)
  Top 0.203: v83.52,79.96 85.34,81.79 91.95,81.79 94.59,84.43 141.43,84.43 v141.73,84.12
  Bottom 0.203: v83.52,79.96 83.52,78.74 3X8BUT_IC4.9 | v141.73,84.12 144.88,80.97 144.88,78.74 3X8BUT_IC5.14
SO-OUTPUT/J2  (via drill 0.33)
  Top 0.203: v140.61,82.6 143.36,82.6 145.39,84.63 175.26,84.63 177.9,87.27 3X8BUT_J2.6
  Bottom 0.203: v140.61,82.6 140.61,82.09 138.79,80.26 138.79,78.84 138.68,78.74 3X8BUT_IC5.9

## Text on the board
tNames: RC | SC | SI | 5V | GND | J1 | SO | IN
bNames: SO | GND | 5V | SI | SC | RC